# EAGLE schematic usb_midi_dmx (EAGLE 6.5.0)
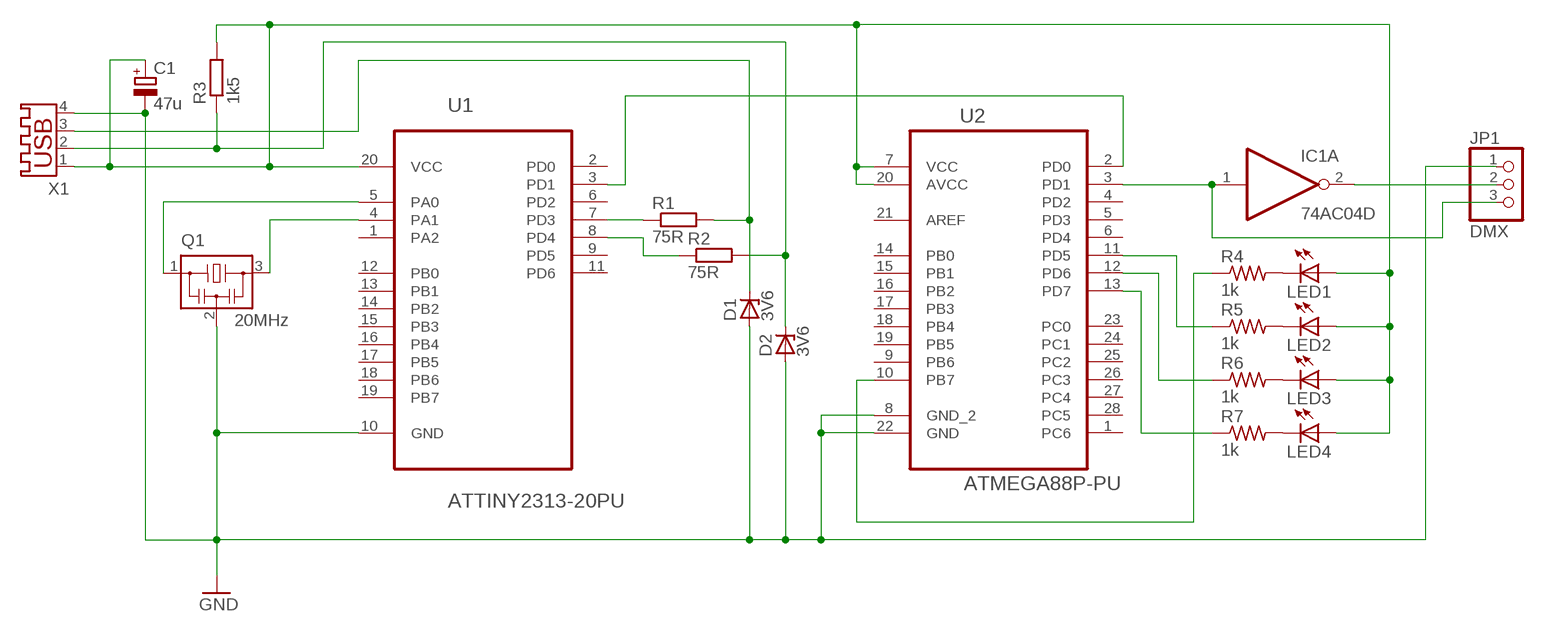
[diagram p0: schematic, sheet 1]

## Parts
C1  47u  CPOL-EU085CS-1AR  [085CS_1AR]
D1  3V6  1N4728  [DO41Z10]
D2  3V6  1N4728  [DO41Z10]
IC1  74AC04D  [SO14]
JP1  DMX  PINHD-1X3  [1X03]
LED1  LED  [SMARTLED-TTW]
LED2  LED  [SMARTLED-TTW]
LED3  LED  [SMARTLED-TTW]
LED4  LED  [SMARTLED-TTW]
Q1  20MHz  CSTCR6M00G53Z  [CSTCR6M]
R1  75R  R-EU_0204/2V  [0204V]
R2  75R  R-EU_0204/2V  [0204V]
R3  1k5  R-EU_0204/2V  [0204V]
R4  1k  R-US_0204/2V  [0204V]
R5  1k  R-US_0204/2V  [0204V]
R6  1k  R-US_0204/2V  [0204V]
R7  1k  R-US_0204/2V  [0204V]
U1  ATTINY2313-20PU  [DIP254P762X533-20]
U2  ATMEGA88P-PU  ATMEGA328P-PU  [DIP254P762X457-28]
X1  USB-A003  [USB-A003]

## Nets
GND: C1.- D1.A D2.A JP1.1 Q1.2 U1.10(GND) U2.8(GND_2) U2.22(GND) X1.4
N$1: Q1.3 U1.4(PA1)
N$2: Q1.1 U1.5(PA0)
N$3: R5.1 U2.11(PD5)
N$4: R2.1 U1.8(PD4)
N$5: C1.+ LED1.A@1(A) LED2.A@1(A) LED3.A@1(A) LED4.A@1(A) R3.2 U1.20(VCC) U2.7(VCC) U2.20(AVCC) X1.1
N$6: R1.1 U1.7(PD3)
N$7: U1.3(PD1) U2.2(PD0)
N$8: D1.C R1.2 X1.3
N$9: D2.C R2.2 R3.1 X1.2
N$10: IC1.1(A:I) JP1.3 U2.3(PD1)
N$11: IC1.2(A:O) JP1.2
N$12: R6.1 U2.12(PD6)
N$13: R7.1
N$14: R4.1 U2.10(PB7)
N$15: LED1.C@1(C) R4.2
N$16: LED2.C@1(C) R5.2
N$17: LED3.C@1(C) R6.2
N$18: LED4.C@1(C) R7.2
Unconnected: IC1.3(B:I) IC1.4(B:O) IC1.5(C:I) IC1.6(C:O) IC1.8(D:O) IC1.9(D:I) IC1.10(E:O) IC1.11(E:I) IC1.12(F:O) IC1.13(F:I) U1.1(PA2) U1.2(PD0) U1.6(PD2) U1.9(PD5) U1.11(PD6) U1.12(PB0) U1.13(PB1) U1.14(PB2) U1.15(PB3) U1.16(PB4) U1.17(PB5) U1.18(PB6) U1.19(PB7) U2.1(PC6) U2.4(PD2) U2.5(PD3) U2.6(PD4) U2.9(PB6) U2.13(PD7) U2.14(PB0) U2.15(PB1) U2.16(PB2) U2.17(PB3) U2.18(PB4) U2.19(PB5) U2.21(AREF) U2.23(PC0) U2.24(PC1) U2.25(PC2) U2.26(PC3) U2.27(PC4) U2.28(PC5)

## Power pins joined to a net without a drawn wire
GND: IC1.7(P:GND)
VCC: IC1.14(P:VCC)

## Library data of the parts
C1 = resistor:CPOL-EU: POLARIZED CAPACITOR, European symbol
D1 D2 = diode:1N4728: Z DIODE 3.3 V, 1W, 5 percent
IC1 = 74xx-eu:74*04: Hex INVERTER
JP1 = pinhead:PINHD-1X3: PIN HEADER
LED1-LED4 = led:LED: LED OSRAM: - CHIPLED LG R971, LG N971, LY N971, LG Q971, LY Q971, LO R971, LY R971 LH N974, LH R974 LS Q976, LO Q976, LY Q976 LO Q996 - Hyper CHIPLED LW Q18S LB Q993, LB Q99A, LB R99A - SideLED LS A670, LO A670, LY A670, LG A670, LP A670 LB A673, LV A673, LT A673, LW A673 LH A674 LY A675 LS A676, LA A676, LO A676, LY A676, LW A676 LS A679, LY A679, LG A679 - Hyper Micro SIDELED® LS Y876, LA Y876, LO Y876, LY Y876 LT Y87S - SmartLED LW L88C, LW L88S LB L89C, LB L89S, LG L890 LS L89K, LO L89K, LY L89K LS L896, LA L896, LO L896, LY L896 - TOPLED LS T670, LO T670, LY T670, LG T670, LP T670 LSG T670, LSP T670, LSY T670, LOP T670, LYG T670 LG T671, LOG T671, LSG T671 LB T673, LV T673, LT T673, LW T673 LH T674 LS T676, LA T676, LO T676, LY T676, LB T676, LH T676, LSB T676, LW T676 LB T67C, LV T67C, LT T67C, LS T67K, LO T67K, LY T67K, LW E67C LS E67B, LA E67B, LO E67B, LY E67B, LB E67C, LV E67C, LT E67C LW T67C LS T679, LY T679, LG T679 LS T770, LO T770, LY T770, LG T770, LP T770 LB T773, LV T773, LT T773, LW T773 LH T774 LS E675, LA E675, LY E675, LS T675 LS T776, LA T776, LO T776, LY T776, LB T776 LHGB T686 LT T68C, LB T68C - Hyper Mini TOPLED® LB M676 - Mini TOPLED Santana® LG M470 LS M47K, LO M47K, LY M47K Source: http://www.osram.convergy.de LUXEON: - LUMILED® LXK2-PW12-R00, LXK2-PW12-S00, LXK2-PW14-U00, LXK2-PW14-V00 LXK2-PM12-R00, LXK2-PM12-S00, LXK2-PM14-U00 LXK2-PE12-Q00, LXK2-PE12-R00, LXK2-PE12-S00, LXK2-PE14-T00, LXK2-PE14-U00 LXK2-PB12-K00, LXK2-PB12-L00, LXK2-PB12-M00, LXK2-PB14-N00, LXK2-PB14-P00, LXK2-PB14-Q00 LXK2-PR12-L00, LXK2-PR12-M00, LXK2-PR14-Q00, LXK2-PR14-R00 LXK2-PD12-Q00, LXK2-PD12-R00, LXK2-PD12-S00 LXK2-PH12-R00, LXK2-PH12-S00 LXK2-PL12-P00, LXK2-PL12-Q00, LXK2-PL12-R00 Source: www.luxeon.com KINGBRIGHT: KA-3528ASYC Source: www.kingbright.com
Q1 = murata-filter:CSTCR: Resonator Source: murata.co.jp; MPN: CSTCR6M00G53-R0; OC_FARNELL: 1170434; OC_NEWARK: 25M8759
R1-R3 = resistor:R-EU_: RESISTOR, European symbol
R4-R7 = resistor:R-US_: RESISTOR, American symbol
U1 = Atmel_By_element14_Batch_1:ATTINY2313-20PU: Microcontroller; MPN: ATTINY2313-20PU; OC_FARNELL: 9171592; OC_NEWARK: 96K6525; PACKAGE: DIP-20; SUPPLIER: ATMEL
U2 = Atmel_By_element14_Batch_1:ATMEGA328P-PU: 8-bit Microcontroller with In-System Programmable Flash; MPN: ATMEGA328P-PU; OC_FARNELL: 1715487; OC_NEWARK: 15R0268; PACKAGE: PDIP-28; SUPPLIER: Atmel
X1 = con-yamaichi:USB-A003: USB connector; OC_FARNELL: unknown; OC_NEWARK: unknown